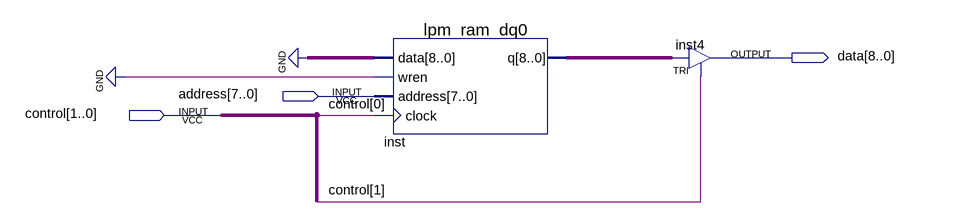
[diagram p0: schematic sheet]
// Quartus schematic RAM.bdf as structural Verilog: 2 symbols, 3 pins
module RAM (
  input  [7:0] address,
  input  [1:0] control,
  output [8:0] data
);

  wire [8:0] inst_q;

  lpm_ram_dq0 inst (.data({9{1'b0}}), .wren(1'b0), .address(address), .clock(control[0]), .q(inst_q));
  TRI inst4[8:0] (.IN(inst_q), .OE(control[1]), .OUT(data));
endmodule
